# EAGLE design nosecone (EAGLE 9.6.2)

## Sheet 1 of 3: Board to Board Headers
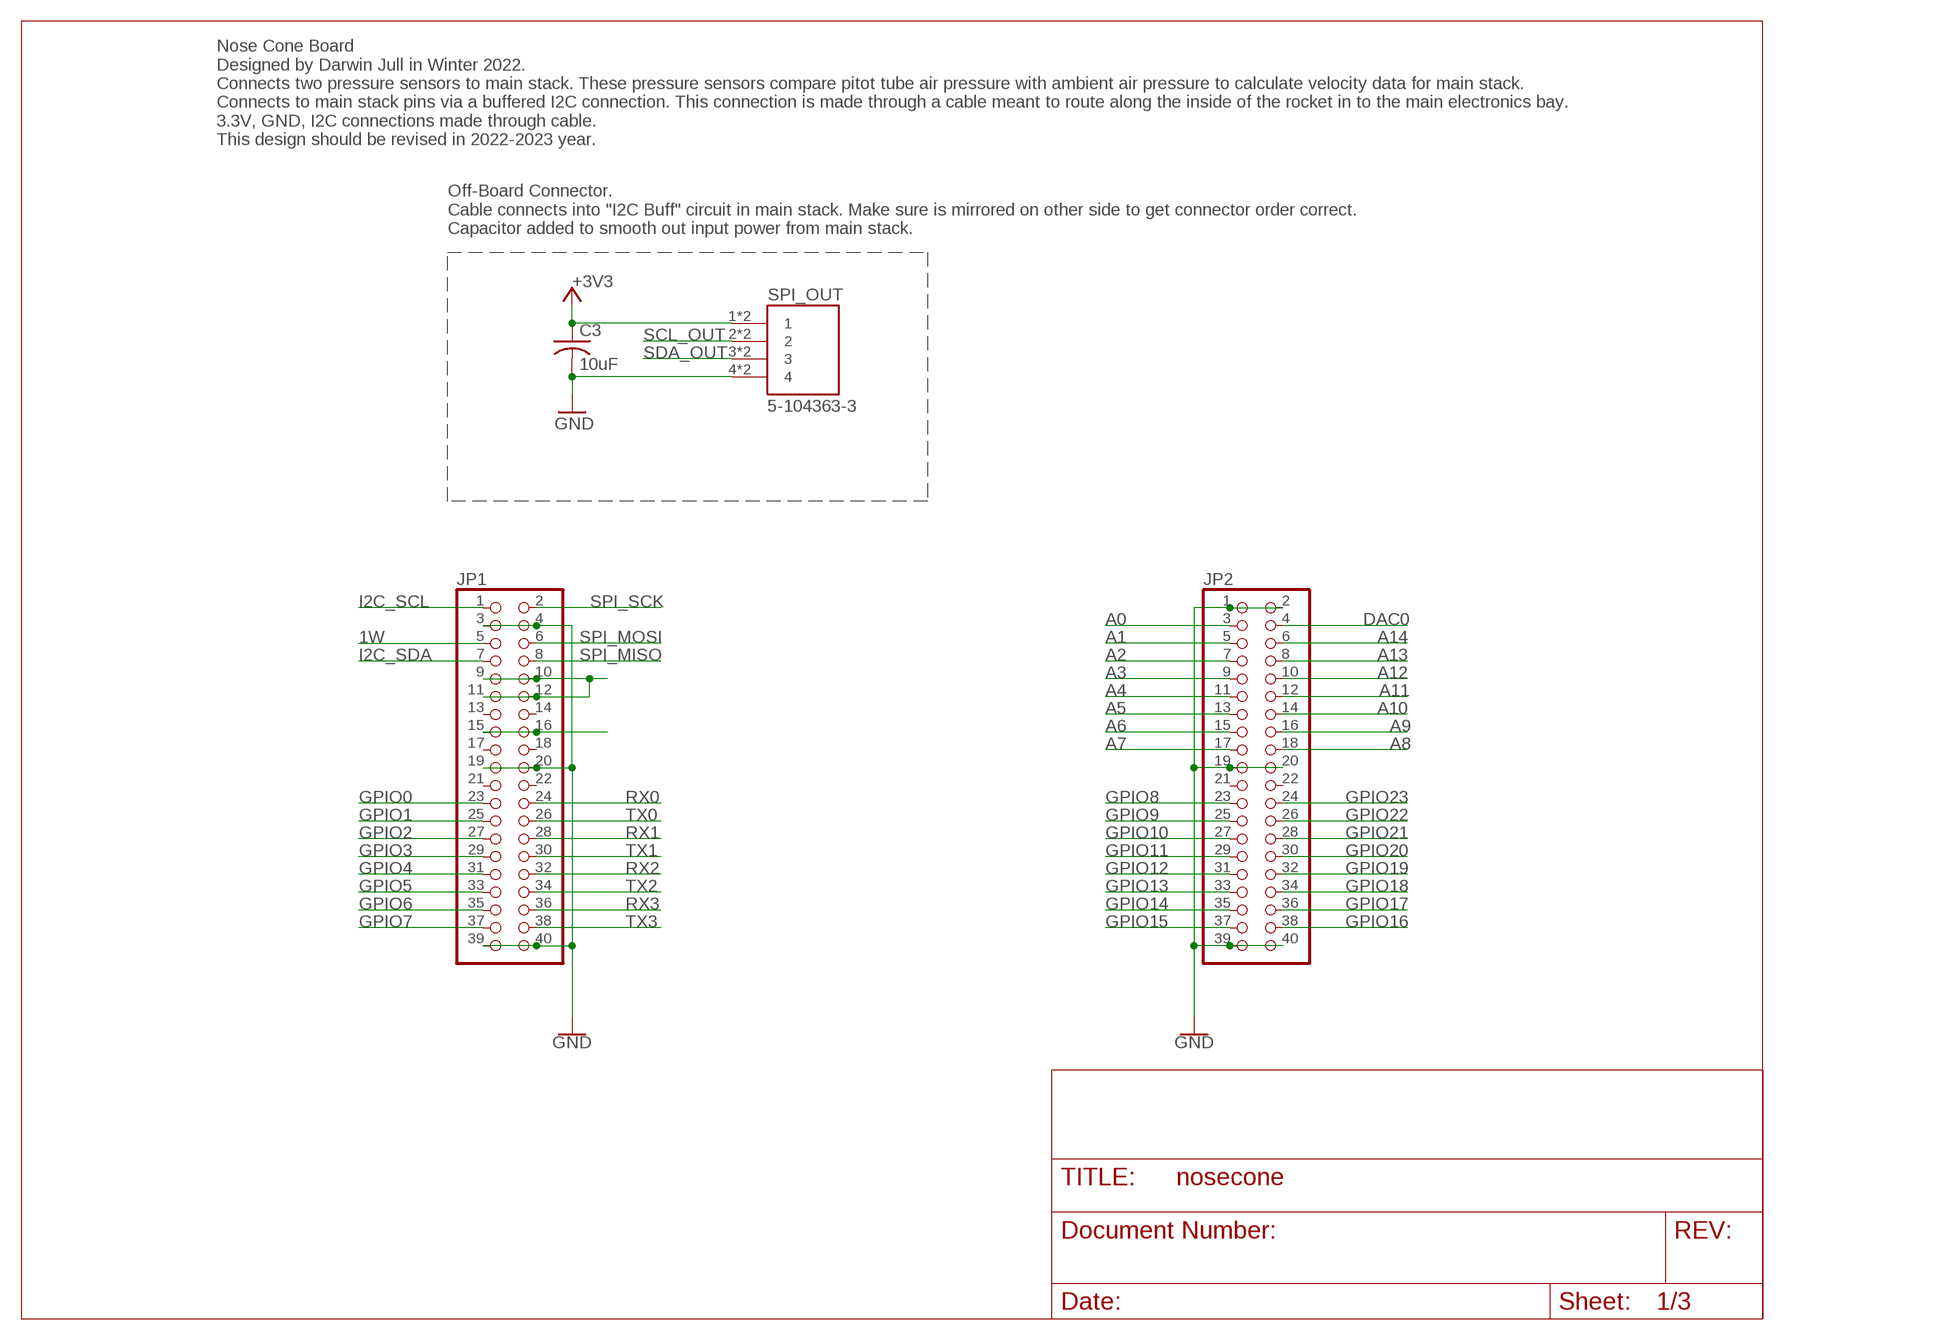
[diagram p0: schematic, sheet 1]

### Parts
C3  10uF  C-USC0805  [C0805]
JP1  PINHD-2X20  [2X20]
JP2  PINHD-2X20  [2X20]
SPI_OUT  5-104363-3  [TE_5-104363-3]

### Nets
1W: JP1.5
+3V3: C3.1 SPI_OUT.1 SPI_OUT.1_1 ; also sheet 2,3
A0: JP2.3
A1: JP2.5
A2: JP2.7
A3: JP2.9
A4: JP2.11
A5: JP2.13
A6: JP2.15
A7: JP2.17
A8: JP2.18
A9: JP2.16
A10: JP2.14
A11: JP2.12
A12: JP2.10
A13: JP2.8
A14: JP2.6
DAC0: JP2.4
GND: C3.2 JP1.3 JP1.4 JP1.19 JP1.20 JP1.39 JP1.40 JP2.1 JP2.2 JP2.19 JP2.20 JP2.39 JP2.40 SPI_OUT.4 SPI_OUT.4_1 ; also sheet 2,3
GPIO0: JP1.23
GPIO1: JP1.25
GPIO2: JP1.27
GPIO3: JP1.29
GPIO4: JP1.31
GPIO5: JP1.33
GPIO6: JP1.35
GPIO7: JP1.37
GPIO8: JP2.23
GPIO9: JP2.25
GPIO10: JP2.27
GPIO11: JP2.29
GPIO12: JP2.31
GPIO13: JP2.33
GPIO14: JP2.35
GPIO15: JP2.37
GPIO16: JP2.38
GPIO17: JP2.36
GPIO18: JP2.34
GPIO19: JP2.32
GPIO20: JP2.30
GPIO21: JP2.28
GPIO22: JP2.26
GPIO23: JP2.24
I2C_SCL: JP1.1 ; also sheet 2,3
I2C_SDA: JP1.7 ; also sheet 2,3
N$2: JP1.9 JP1.10 JP1.11 JP1.12
N$3: JP1.15 JP1.16
RX0: JP1.24
RX1: JP1.28
RX2: JP1.32
RX3: JP1.36
SCL_OUT: SPI_OUT.2 SPI_OUT.2_1 ; also sheet 2
SDA_OUT: SPI_OUT.3 SPI_OUT.3_1 ; also sheet 2
SPI_MISO: JP1.8
SPI_MOSI: JP1.6
SPI_SCK: JP1.2
TX0: JP1.26
TX1: JP1.30
TX2: JP1.34
TX3: JP1.38
Unconnected: JP1.13 JP1.14 JP1.17 JP1.18 JP1.21 JP1.22 JP2.21 JP2.22

### Notes on the sheet
- Nose Cone Board
  Designed by Darwin Jull in Winter 2022.
  Connects two pressure sensors to main stack. These pressure sensors compare pitot tube air pressure with ambient air pressure to calculate velocity data for main stack.
  Connects to main stack pins via a buffered I2C connection. This connection is made through a cable meant to route along the inside of the rocket in to the main electronics bay.
  3.3V, GND, I2C connections made through cable. 
  This design should be revised in 2022-2023 year.
- Off-Board Connector. 
  Cable connects into "I2C Buff" circuit in main stack. Make sure is mirrored on other side to get connector order correct. 
  Capacitor added to smooth out input power from main stack.

## Sheet 2 of 3: CAN
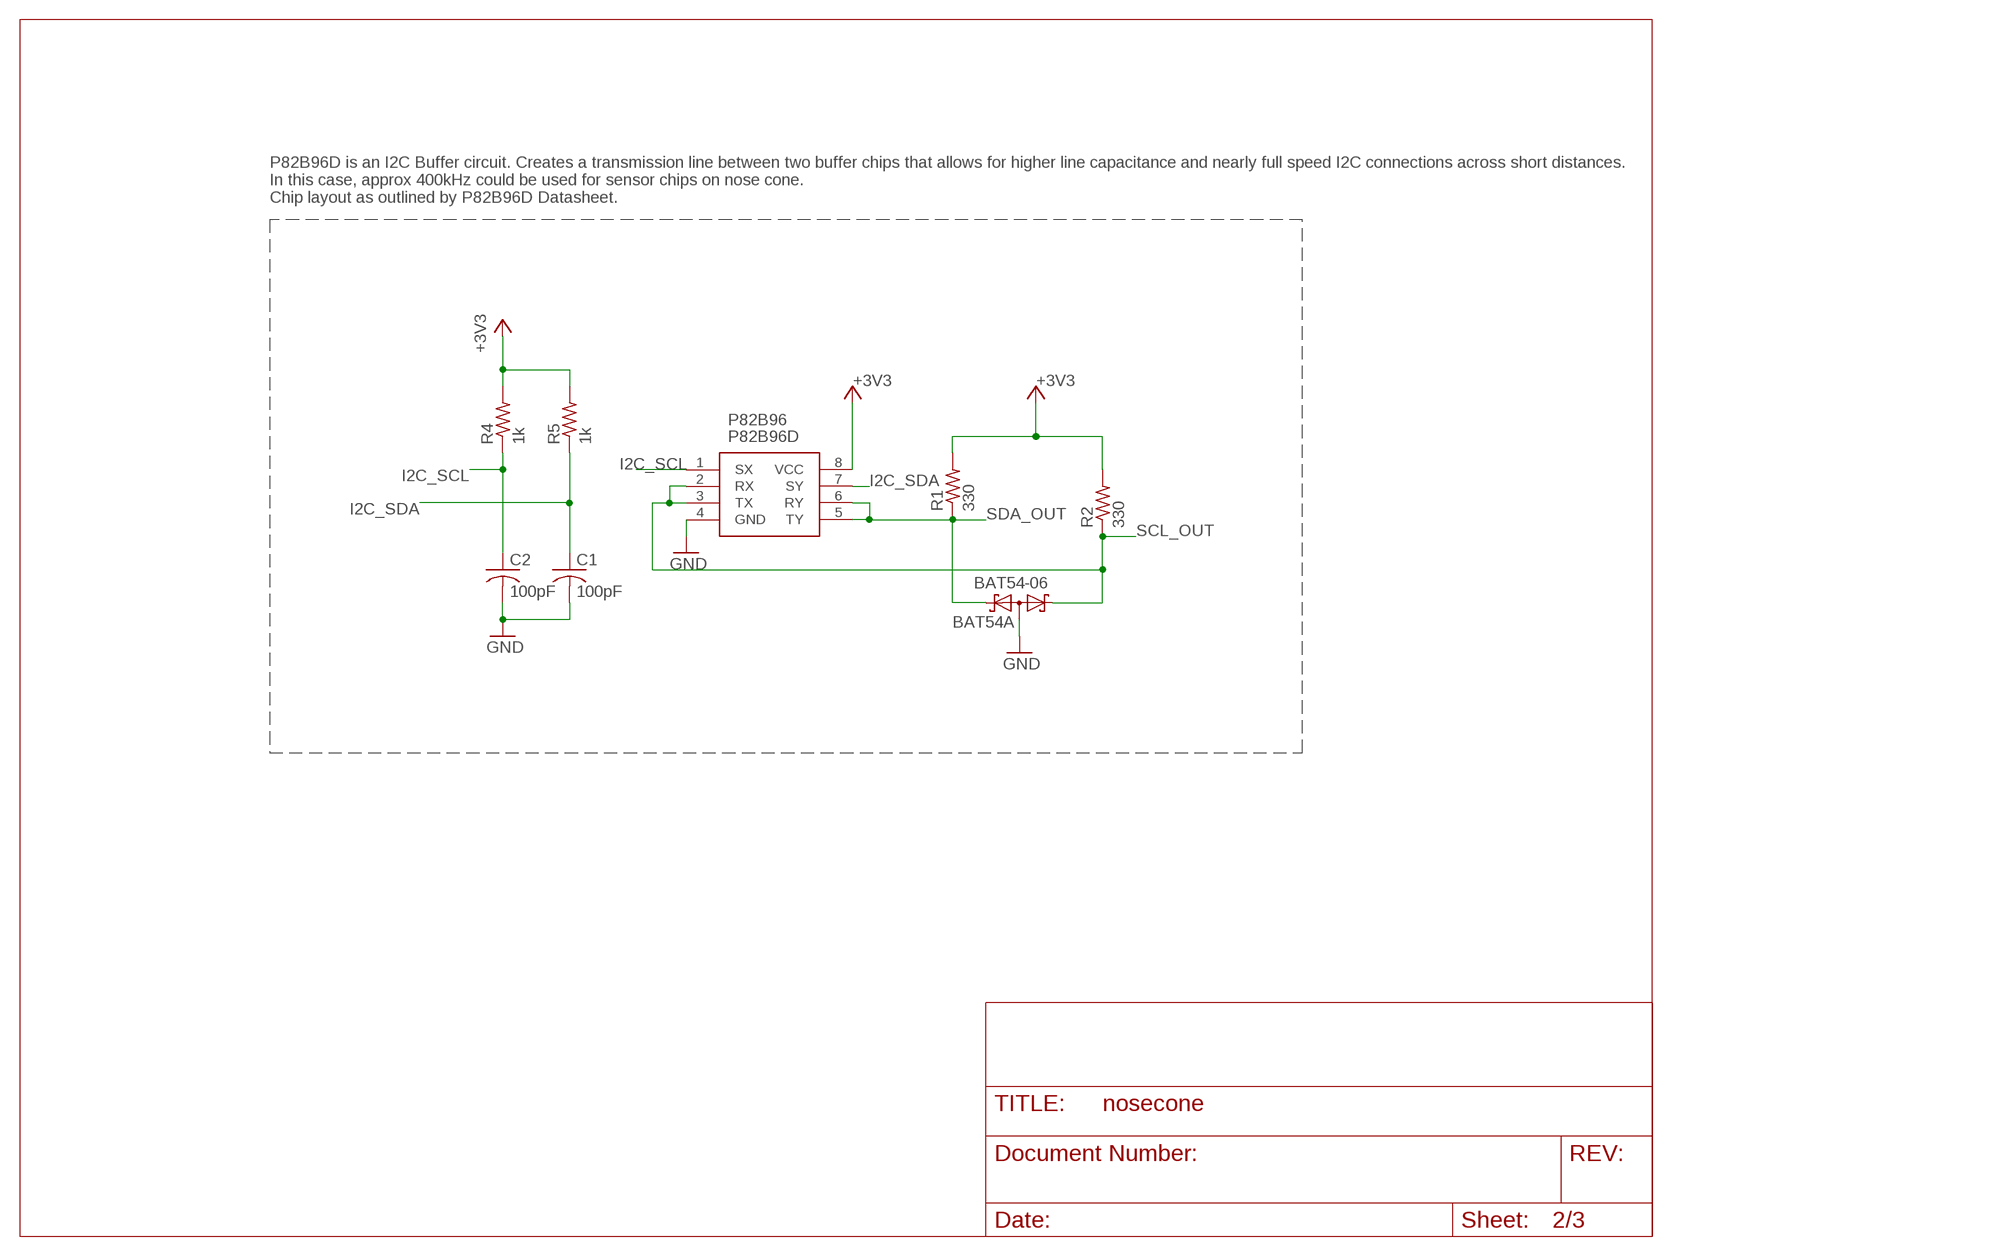
[diagram p1: schematic, sheet 2]

### Parts
C1  100pF  C-USC0805  [C0805]
C2  100pF  C-USC0805  [C0805]
D1  BAT54-06  [SOT23]
P82B96  P82B96D  [SOIC127P600X175-8N]
R1  330  R-US_R0805  [R0805]
R2  330  R-US_R0805  [R0805]
R4  1k  R-US_R0805  [R0805]
R5  1k  R-US_R0805  [R0805]

### Nets
+3V3: P82B96.8(VCC) R1.2 R2.2 R4.2 R5.2 ; also sheet 1,3
GND: C1.2 C2.2 D1.3 P82B96.4(GND) ; also sheet 1,3
I2C_SCL: C2.1 P82B96.1(SX) R4.1 ; also sheet 1,3
I2C_SDA: C1.1 P82B96.7(SY) R5.1 ; also sheet 1,3
SCL_OUT: D1.1 P82B96.2(RX) P82B96.3(TX) R2.1 ; also sheet 1
SDA_OUT: D1.2 P82B96.5(TY) P82B96.6(RY) R1.1 ; also sheet 1

### Notes on the sheet
- P82B96D is an I2C Buffer circuit. Creates a transmission line between two buffer chips that allows for higher line capacitance and nearly full speed I2C connections across short distances.
  In this case, approx 400kHz could be used for sensor chips on nose cone.
  Chip layout as outlined by P82B96D Datasheet.

## Sheet 3 of 3: Sensors
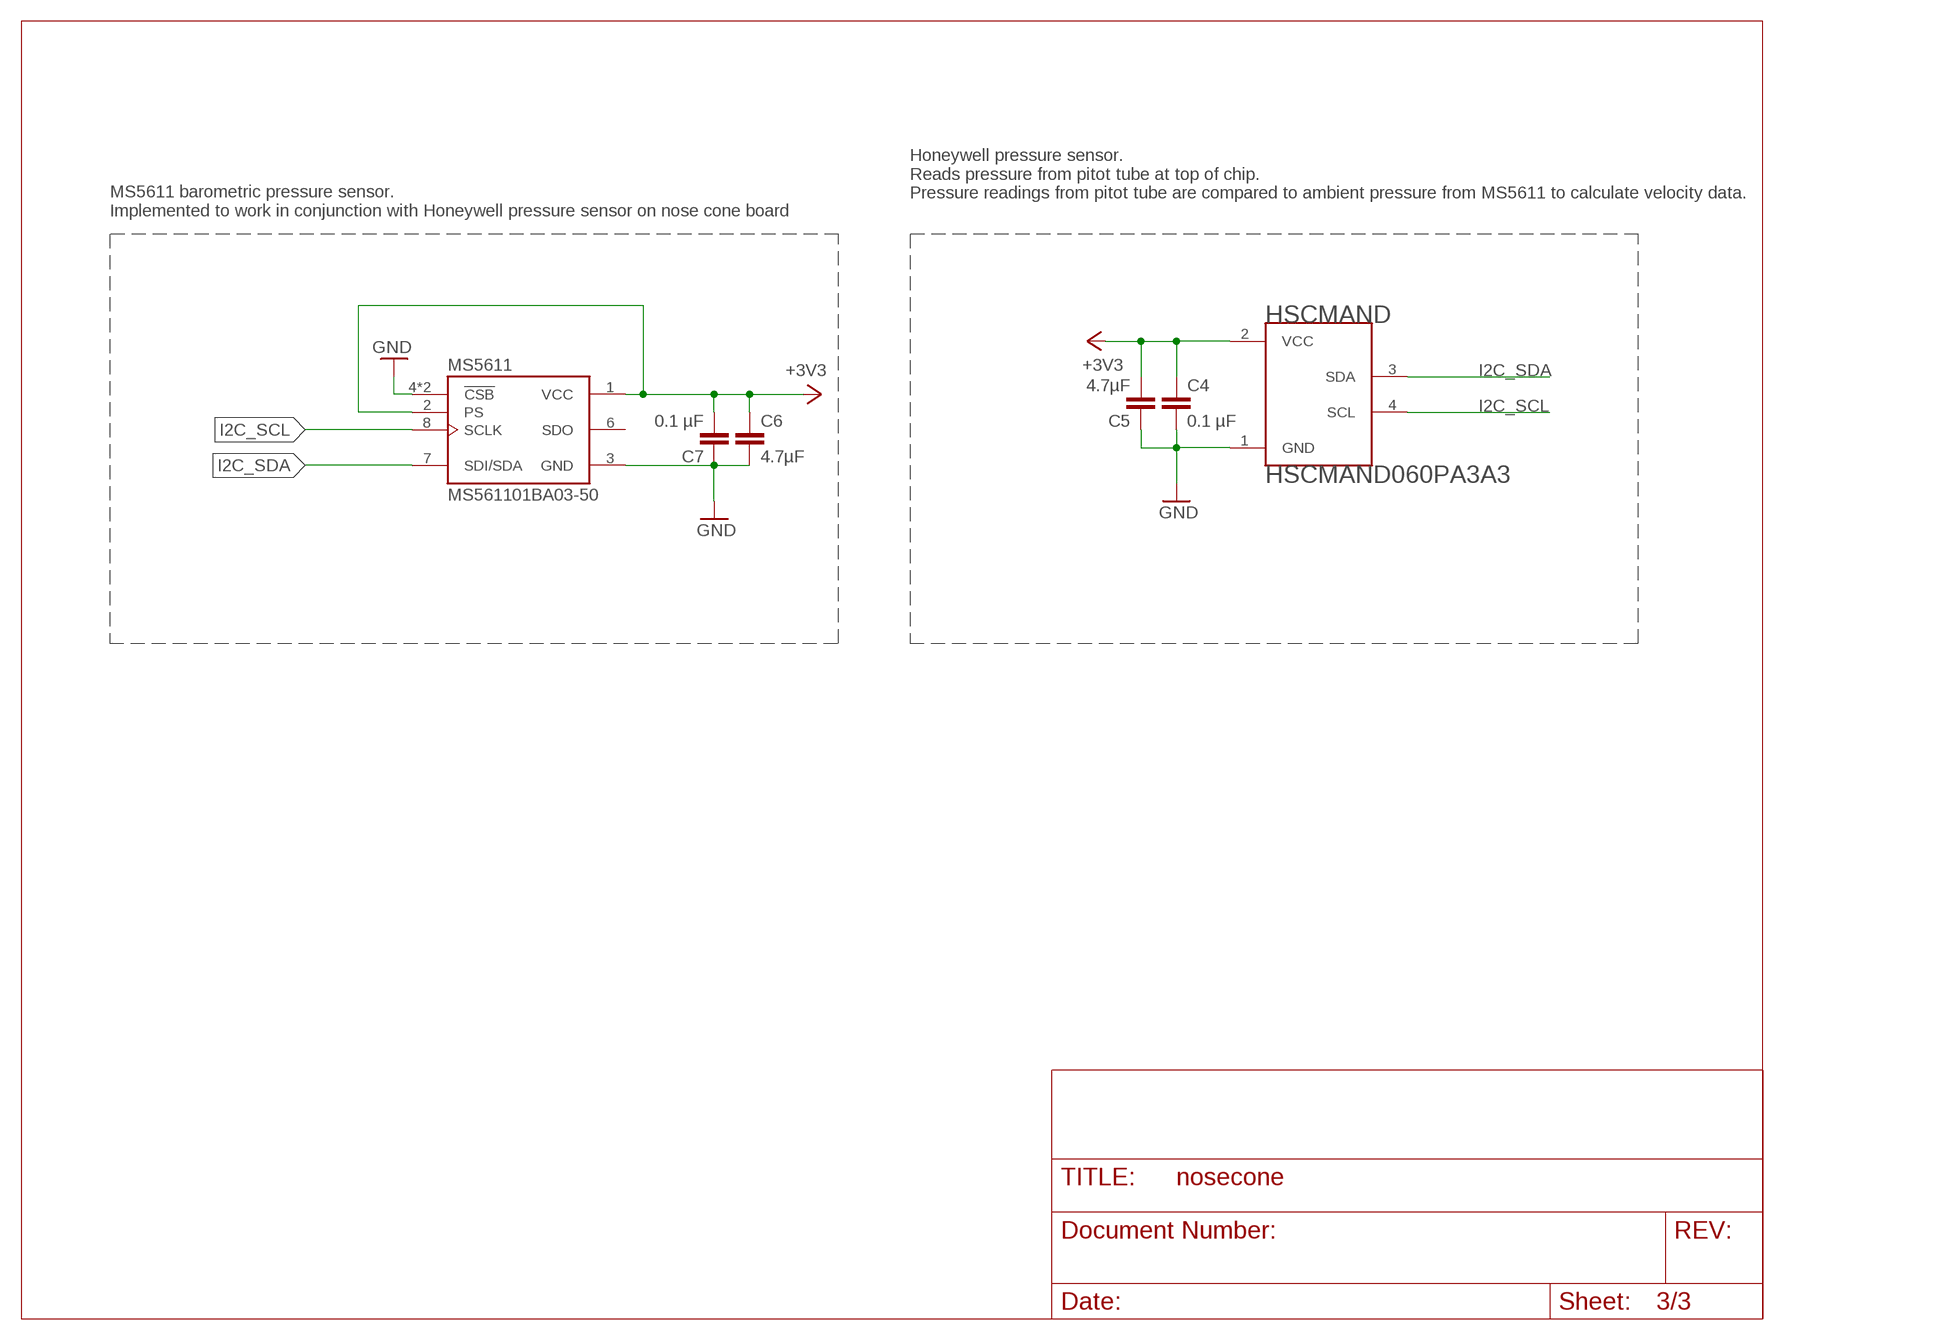
[diagram p2: schematic, sheet 3]

### Parts
C4  0.1 µF  C-EUC0805  [C0805]
C5  4.7µF  C-EUC0805  [C0805]
C6  4.7µF  C-EUC0805  [C0805]
C7  0.1 µF  C-EUC0805  [C0805]
HSCMAND  HSCMAND060PA3A3  [HSC-SMT]
MS5611  MS561101BA03-50  [SON125P500X300X100-8N]

### Nets
+3V3: C4.1 C5.2 C6.1 C7.2 HSCMAND.2(VCC) MS5611.1(VCC) MS5611.2(PS) ; also sheet 1,2
GND: C4.2 C5.1 C6.2 C7.1 HSCMAND.1(GND) MS5611.3(GND) MS5611.4(!CSB) MS5611.5(!CSB) ; also sheet 1,2
I2C_SCL: HSCMAND.4(SCL) MS5611.8(SCLK) ; also sheet 1,2
I2C_SDA: HSCMAND.3(SDA) MS5611.7(SDI/SDA) ; also sheet 1,2
Unconnected: MS5611.6(SDO)

### Notes on the sheet
- Honeywell pressure sensor. 
  Reads pressure from pitot tube at top of chip.
  Pressure readings from pitot tube are compared to ambient pressure from MS5611 to calculate velocity data.
- MS5611 barometric pressure sensor.
  Implemented to work in conjunction with Honeywell pressure sensor on nose cone board

## Library data of the parts
C1-C3 = rcl:C-US: CAPACITOR, American symbol; SPICEPREFIX: C
C4-C7 = rcl:C-EU: CAPACITOR, European symbol; SPICEPREFIX: C
D1 = DJCUINSPACEV1:BAT54-06
HSCMAND = nose-cone:HSCMAND060PA3A3
JP1 JP2 = pinhead:PINHD-2X20: PIN HEADER
MS5611 = nose-cone:MS561101BA03-50: BAROMETRIC PRESSURE SENSOR; AVAILABILITY: Unavailable; COMMENT: MS561101BA03-50; DESCRIPTION: Barometric Pressure Sensor; EU_ROHS_COMPLIANCE: Compliant; MF: TE Connectivity; MP: MS561101BA03-50; PACKAGE: SMD-8 TE Connectivity; PRICE: None; TE_PURCHASE_URL: https://www.te.com/usa-en/product-MS561101BA03-50.html?te_bu=Cor&te_type=disp&te_campaign=seda_glo_cor-seda-global-disp-prtnr-fy19-seda-model-bom-cta_sma-317_1&elqCampaignId=32493
P82B96 = P82B96D:P82B96D: Texas Instruments P82B96D, Dual, Bus Buffer, 2 15 V, 8-Pin SOIC Source: Datasheet <http://www.ti.com/lit/gpn/P82B96>; ARROW_PART_NUMBER: P82B96D; ARROW_PRICE-STOCK: https://www.arrow.com/en/products/p82b96d/texas-instruments; DESCRIPTION: Texas Instruments P82B96D, Dual, Bus Buffer, 2 15 V, 8-Pin SOIC; HEIGHT: 1.75mm; MANUFACTURER_NAME: Texas Instruments; MANUFACTURER_PART_NUMBER: P82B96D; MOUSER_PART_NUMBER: 595-P82B96D; MOUSER_PRICE-STOCK: https://www.mouser.co.uk/ProductDetail/Texas-Instruments/P82B96D?qs=aEuGZpxfbxXCtC%252BvOJGocw%3D%3D
R1 R2 R4 R5 = rcl:R-US_: RESISTOR, American symbol; SPICEPREFIX: R
SPI_OUT = 5-104363-3:5-104363-3: 4 Positions Header Connector 0.100" (2.54mm) Through Hole Gold; DESCRIPTION: Conn Shrouded Header (4 Sides) HDR 4 POS 2.54mm Solder ST Thru-Hole Box/Tube; DIGI-KEY_PART_NUMBER: A32565-ND; MF: TE Connectivity; MP: 51043633; PACKAGE: None

## Board
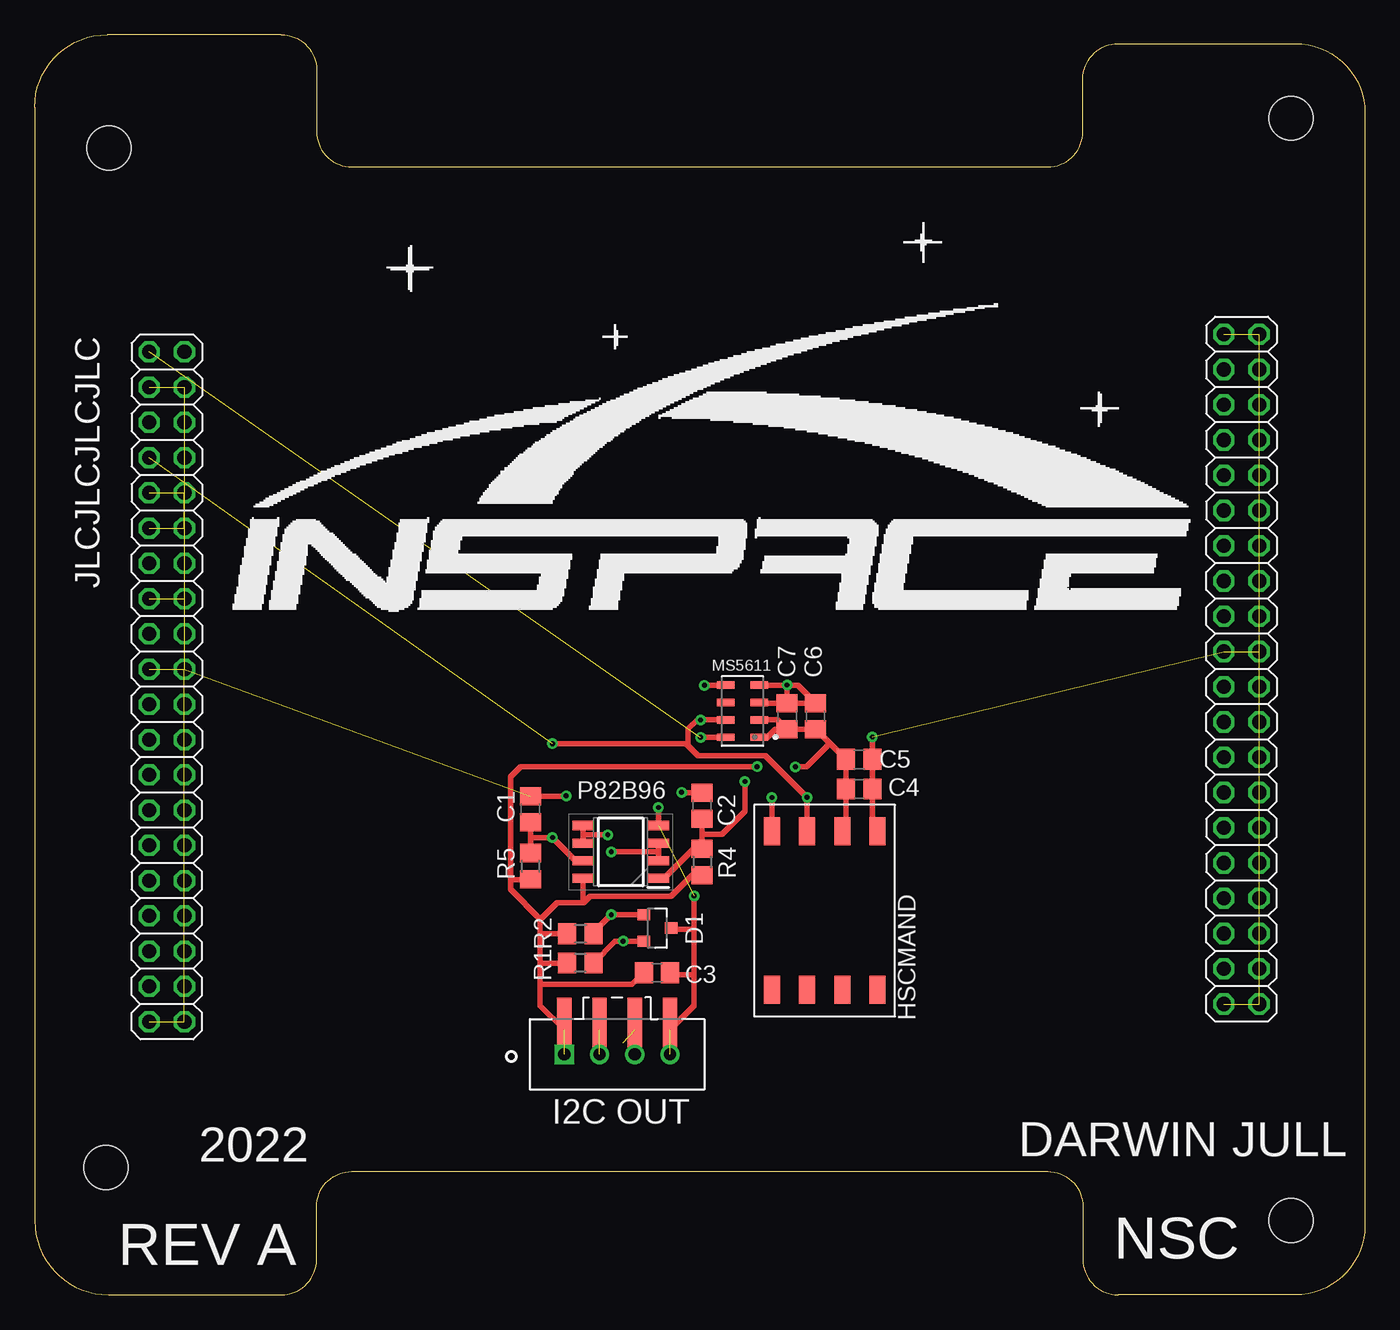
[diagram p3: board, top side]
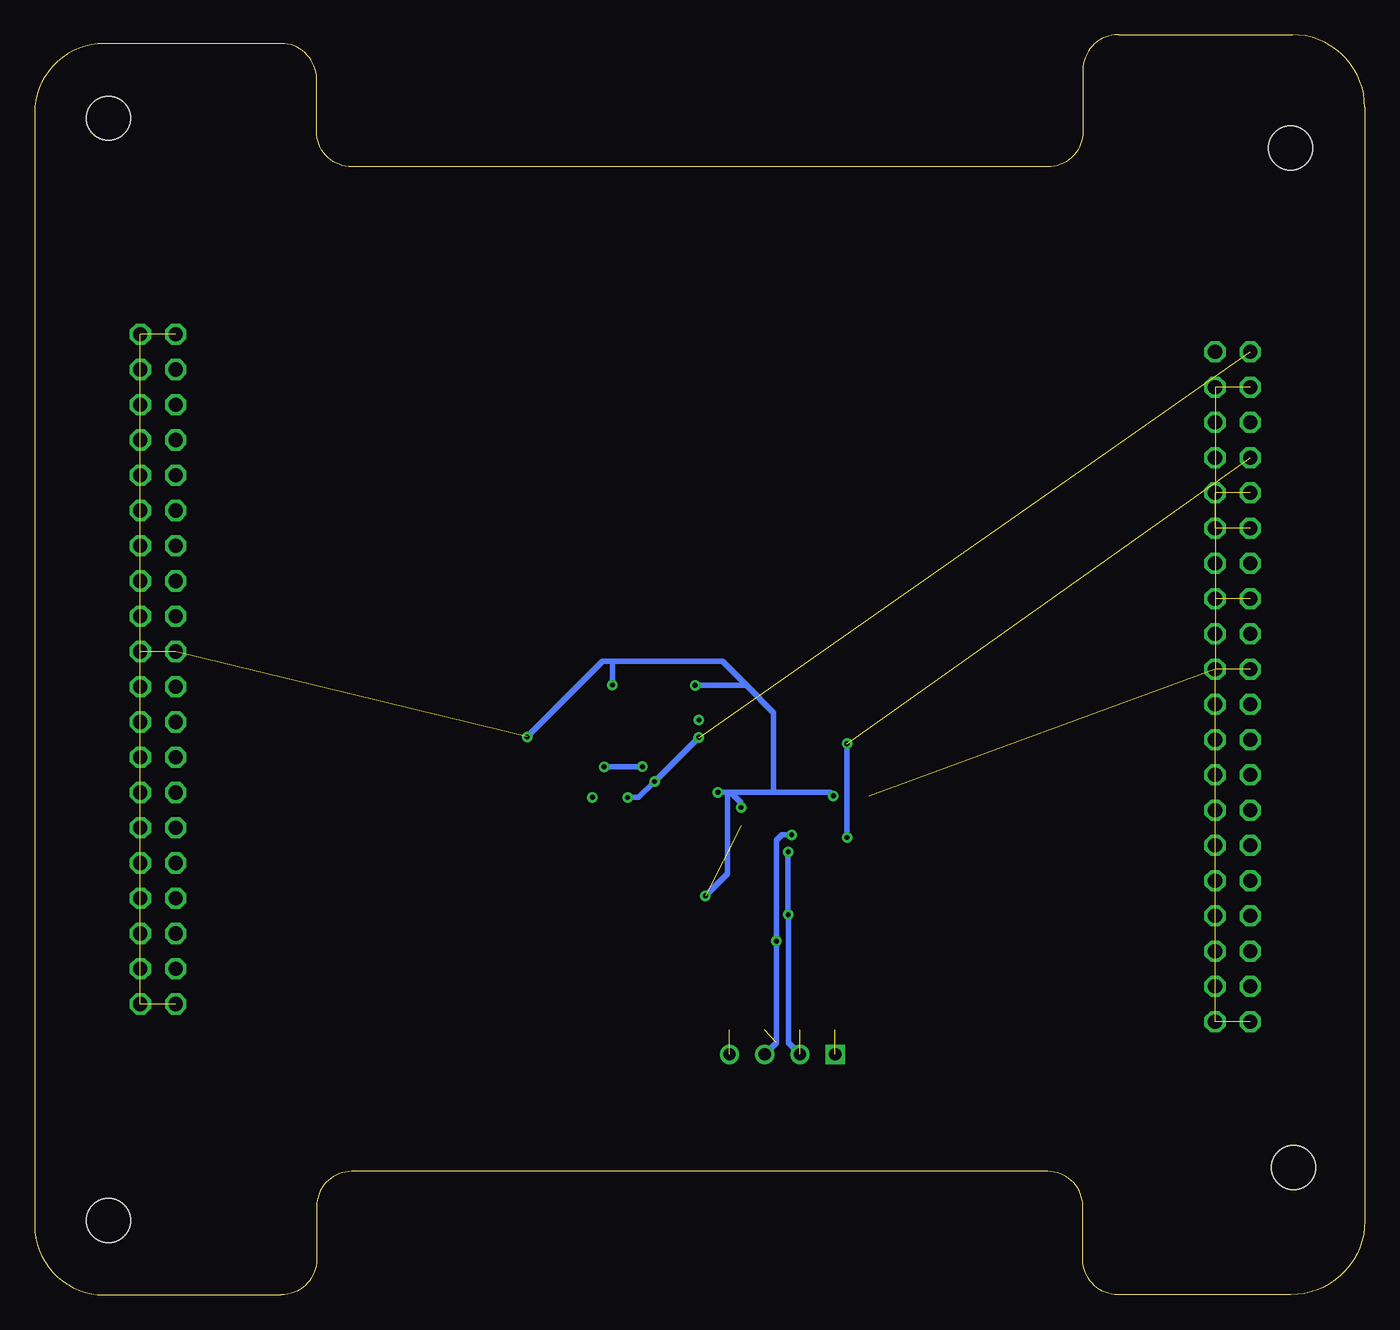
[diagram p4: board, bottom side, seen from below]

Size 95.89 x 90.81 mm. Coordinates in mm from the lower left corner, seen from the top.
Outline: 0,85.57 0,5.33 arc90 5.33,0 17.78,0 arc90 20.32,2.54 20.32,6.35 arc-90 22.86,8.89 73.03,8.89 arc-90 75.56,6.35 75.56,2.54 arc90 78.11,0 90.89,0 arc90 95.89,5 95.89,85.17 arc90 90.89,90.17 78.11,90.17 arc90 75.56,87.63 75.56,83.82 arc-90 73.03,81.28 22.86,81.28 arc-90 20.32,83.82 20.32,88.27 arc90 17.78,90.81 5.23,90.81 arc90 0,85.57
Copper layers (1*16): Top 0.035mm / dielectric 1.3mm / Bottom 0.035mm
Design rules "CUINSPACE_Design Rules *": minimum track width 6mil, minimum drill 0.35mm, track to track 6mil, track to pad 6mil, pad to pad 6mil, via to via 6mil, smd to smd 6mil, copper to edge 40mil, drill to drill 6mil, minimum pad ring 10mil, minimum via ring 8mil, stop-mask expansion 4mil, vias tented up to drill 0mil, thermal gap 10mil
Holes 3.17 mm at 5.13,9.17 5.36,82.65 90.55,84.79 90.55,5.36

### Footprints (pad centres in the part's own frame; a part is rotated, then mirrored left to right if it is on the bottom)
C0805 = smd 1.3 x 1.5: 1 -0.95,0; 2 0.95,0
SOT23 = smd 0.8 x 0.9: 1 -0.95,-1; 2 0.95,-1; 3 0,1
HSC-SMT = smd 1.143 x 2.032: 1 -3.81,-5.716; 2 -1.27,-5.716; 3 1.27,-5.716; 4 3.81,-5.716; 5 3.81,5.716; 6 1.27,5.716; 7 -1.27,5.716; 8 -3.81,5.716
2X20 = drill 1.016 octagon: 1 -24.13,-1.27; 2 -24.13,1.27; 3 -21.59,-1.27; 4 -21.59,1.27; 5 -19.05,-1.27; 6 -19.05,1.27; 7 -16.51,-1.27; 8 -16.51,1.27; 9 -13.97,-1.27; 10 -13.97,1.27; 11 -11.43,-1.27; 12 -11.43,1.27; 13 -8.89,-1.27; 14 -8.89,1.27; 15 -6.35,-1.27; 16 -6.35,1.27; 17 -3.81,-1.27; 18 -3.81,1.27; 19 -1.27,-1.27; 20 -1.27,1.27; 21 1.27,-1.27; 22 1.27,1.27; 23 3.81,-1.27; 24 3.81,1.27; 25 6.35,-1.27; 26 6.35,1.27; 27 8.89,-1.27; 28 8.89,1.27; 29 11.43,-1.27; 30 11.43,1.27; 31 13.97,-1.27; 32 13.97,1.27; 33 16.51,-1.27; 34 16.51,1.27; 35 19.05,-1.27; 36 19.05,1.27; 37 21.59,-1.27; 38 21.59,1.27; 39 24.13,-1.27; 40 24.13,1.27
SON125P500X300X100-8N = smd 1.31 x 0.53: 1 -1.2,1.875; 2 -1.2,0.625; 3 -1.2,-0.625; 4 -1.2,-1.875; 5 1.2,-1.875; 6 1.2,-0.625; 7 1.2,0.625; 8 1.2,1.875
SOIC127P600X175-8N = smd 1.528 x 0.65: 1 -2.711,1.905; 2 -2.711,0.635; 3 -2.711,-0.635; 4 -2.711,-1.905; 5 2.711,-1.905; 6 2.711,-0.635; 7 2.711,0.635; 8 2.711,1.905
R0805 = smd 1.3 x 1.5: 1 -0.95,0; 2 0.95,0
TE_5-104363-3 = drill 0.89 pad 1.02 square: 1 -3.81,0 | smd 1.02 x 4.57: 1_1 -3.81,1.775; 2_1 -1.27,1.775; 3_1 1.27,1.775; 4_1 3.81,1.775 | drill 0.89 pad 1.02: 2 -1.27,0; 3 1.27,0; 4 3.81,0

### Placement (x,y rotation side)
C1  35.74,34.99 90 top
C2  48.11,35.25 90 top
C3  44.86,23.21 0 top
C4  59.44,36.45 0 top
C5  59.44,38.59 180 top
C6  56.28,41.69 90 top
C7  54.24,41.69 270 top
D1  44.89,26.43 270 top
HSCMAND  56.95,27.69 180 top
JP1  9.53,43.81 270 top
JP2  87,45.09 270 top
MS5611  51.02,42.06 180 top
P82B96  42.25,31.91 180 top
R1  39.33,23.91 180 top
R2  39.34,26.01 180 top
R4  48.11,31.19 270 top
R5  35.74,30.89 270 top
SPI_OUT  41.99,17.33 0 top
U$2  [INSPACE_7CM]  13.51,48.47 0 top

### Tracks (layer width: path | path; a pad name or v marks a point on that pad's centre or on a via)
+3V3  (via drill 0.35)  (1 unrouted)
  Top 0.406: HSCMAND.2 58.49,33.68 C4.1 C5.2 57.34,39.74 | C7.2 53.38,40.74 52.82,40.18 MS5611.1 | C7.2 C6.1 56.34,40.74 57.34,39.74 | SPI_OUT.1_1 36.44,20.84 36.44,22.37 | 36.44,22.37 36.44,23.91 | 36.44,23.91 36.44,26.02 | 36.44,26.02 36.44,27.03 | 36.44,27.03 37.65,28.24 39.53,28.24 | 39.53,28.24 39.56,28.24 40.03,28.71 45.86,28.71 47.39,30.24 R4.2 | 39.53,28.24 39.53,28.25 P82B96.8 | 36.44,27.03 36.44,27.08 34.29,29.23 34.29,29.92 | 34.29,29.92 34.29,37.34 35.01,38.06 v52.07,38.06 | R2.2 36.45,26.01 36.44,26.02 | R1.2 36.44,23.91 | 36.44,23.91 | C3.1 43.07,22.37 36.44,22.37 | 34.29,29.92 35.72,29.92 R5.2 | MS5611.2 53.55,41.43 C7.2 | 57.34,39.74 55.64,38.05 v54.83,38.05
  Bottom 0.406: v54.83,38.05 v54.82,38.06 v52.07,38.06
GND  (via drill 0.35)  (14 unrouted)
  Top 0.254: 52.26,42.64 MS5611.3 | 54.22,43.93 v54.24,43.95
  Top 0.406: HSCMAND.1 60.39,33.77 C4.2 C5.1 v60.39,40.2 | C7.1 52.26,42.64 | C6.2 C7.1 | C7.1 v54.24,43.95 | MS5611.4 54.22,43.93 55.01,43.93 56.28,42.65 C6.2 | SPI_OUT.4_1 47.53,20.84 47.53,23.08 | 47.53,23.08 47.53,26.34 | 47.53,26.34 v47.53,28.75 | D1.3 45.98,26.34 47.53,26.34 | C3.2 45.94,23.08 47.53,23.08 | C1.2 v38.3,35.94 v38.31,35.95 | C2.2 46.66,36.2 v46.64,36.21 | P82B96.4 v44.96,35.12 | v48.28,43.92 MS5611.5 | 56.34,42.64 C6.2
  Bottom 0.406: v47.53,28.75 45.95,30.33 45.95,36.21 42.62,36.21 | v46.64,36.21 45.72,36.21 44.96,35.45 v44.96,35.12 | v38.31,35.95 38.57,36.21 42.62,36.21 | 42.62,36.21 42.62,41.96 44.58,43.92 | 44.58,43.92 46.3,45.64 54.24,45.64 | v48.28,43.92 44.58,43.92 | 54.24,45.64 54.95,45.64 v60.39,40.2 | v54.24,43.95 54.24,45.64
I2C_SCL  (via drill 0.35)  (1 unrouted)
  Top 0.254: MS5611.8
  Top 0.406: HSCMAND.4 v53.14,35.84 | MS5611.8 v48,40.18 48,40.16 | R4.1 48.11,32.74 | 48.11,33.2 C2.1 | v51.2,36.99 51.2,34.86 49.54,33.2 48.11,33.2 | 48.11,32.74 45.38,30.01 P82B96.1 | 48.11,33.2 48.11,32.74
  Bottom 0.254: JP1.1 8.26,68.24
  Bottom 0.406: v48,40.18 48.01,40.18 v51.2,36.99 52.35,35.84 v53.14,35.84
I2C_SDA  (via drill 0.35)  (1 unrouted)
  Top 0.254: 48.01,41.43 v48,41.42
  Top 0.406: HSCMAND.3 v55.68,35.85 52.68,38.85 47.82,38.85 47.11,39.56 | MS5611.7 48.01,41.43 | R5.1 35.74,32.96 | 35.74,32.96 C1.1 | 35.74,32.96 35.75,32.95 v37.32,32.95 38.99,31.28 P82B96.7 | 47.11,39.56 47.11,40.78 47.75,41.42 v48,41.42 | 47.11,39.56 46.95,39.72 v37.32,39.72
  Bottom 0.406: v37.32,39.72 v37.32,32.95
N$2  (3 unrouted)
N$3  (1 unrouted)
SCL_OUT  (via drill 0.35)  (1 unrouted)
  Top 0.406: R2.1 40.29,26.11 v41.56,27.39 D1.1 | P82B96.3 44.96,31.93 v41.57,31.93 | 44.96,31.85 P82B96.2
  Bottom 0.406: SPI_OUT.2 41.56,18.16 v41.56,27.39 41.56,27.5 41.57,27.5 v41.57,31.93
SDA_OUT  (via drill 0.35)  (1 unrouted)
  Top 0.406: R1.1 41.85,25.48 v42.42,25.48 D1.2 | P82B96.5 39.53,33.15 | 39.53,33.15 P82B96.6 | 39.53,33.15 v41.31,33.15
  Bottom 0.406: SPI_OUT.3 43.24,17.33 42.42,18.15 v42.42,25.48 42.42,32.74 42.01,33.15 v41.31,33.15
SPI_MOSI
  Bottom 0.254: JP1.6 10.79,62.84

### Text on the board
tPlace: JLCJLCJLCJLC | I2C OUT | DARWIN JULL
tNames: 2022 | NSC | REV A